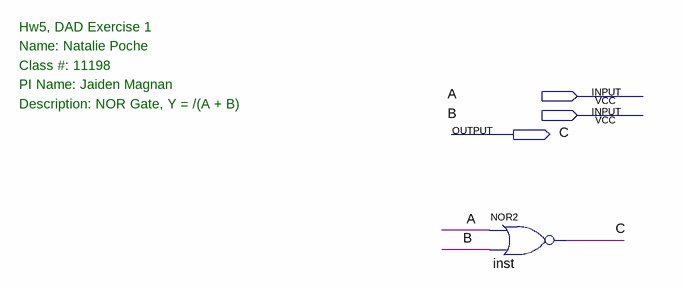
[diagram p0: schematic sheet]
// Quartus schematic Block1.bdf as structural Verilog: 1 symbols, 3 pins
module Block1 (
  input  A,
  input  B,
  output C
);

  nor inst (C, A, B);

  // Notes on the sheet:
  //   Hw5, DAD Exercise 1
  //   Name: Natalie Poche
  //   Class #: 11198
  //   PI Name: Jaiden Magnan
  //   Description: NOR Gate, Y = /(A + B)
endmodule
